# Altium schematic sheet Sheet3.SchDoc
size A4
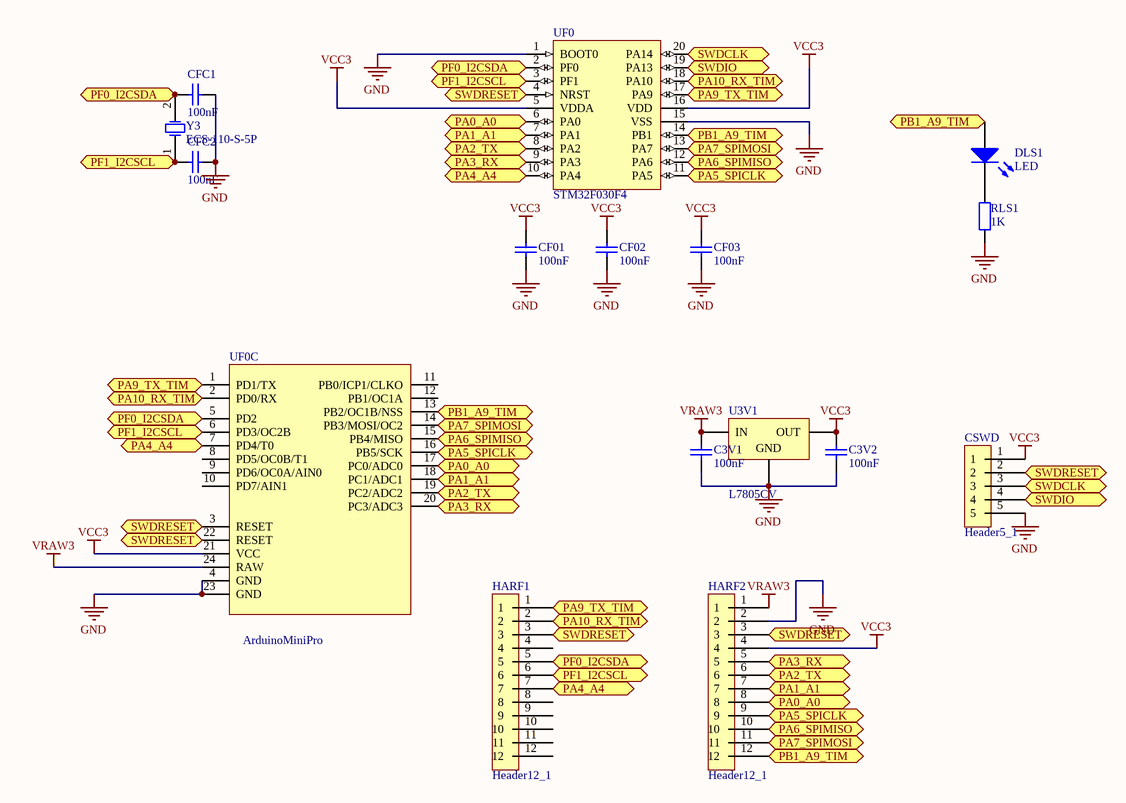
[diagram p0: Sheet3.SchDoc]

## Parts
C3V1  100nF  [FP_1206_CAP_125]
C3V2  100nF  [FP_1206_CAP_125]
CF01  100nF  [FP_0805_CAP_085]
CF02  100nF  [FP_0805_CAP_085]
CF03  100nF  [FP_0805_CAP_085]
CFC1  100nF  [FP_0805_CAP_085]
CFC2  100nF  [FP_0805_CAP_085]
CSWD  Header5_1  [HEADER5x1]
DLS1  LED  [FP_0805_LED_RED]
HARF1  Header12_1  [HEADER12x1]
HARF2  Header12_1  [HEADER12x1]
RLS1  value 1K  [0805]  (hidden comment: Resistor)
U3V1  L7805CV  [SOT-223]
UF0  STM32F030F4  [TSSOP20]
UF0C  ArduinoMiniPro  [DIP24]
Y3  ECS-110-S-5P  [Crystal]

## Ports
PA0_A0, PA1_A1, PA2_TX, PA3_RX, PA4_A4, PA5_SPICLK, PA6_SPIMISO, PA7_SPIMOSI, PA9_TX_TIM, PA10_RX_TIM, PB1_A9_TIM, PF0_I2CSDA, PF1_I2CSCL, SWDCLK, SWDIO, SWDRESET

## Nets
GND: C3V1.2 C3V2.2 CF01.1 CF02.1 CF03.1 CFC1.2 CFC2.2 CSWD.5 HARF2.2 RLS1.1 U3V1.GND UF0.1(BOOT0) UF0.15(VSS) UF0C.4(GND) UF0C.23(GND)
VCC3: C3V2.1 CF01.2 CF02.2 CF03.2 CSWD.1 HARF2.4 U3V1.OUT UF0.5(VDDA) UF0.16(VDD) UF0C.21(VCC)
VRAW3: C3V1.1 HARF2.1 U3V1.IN UF0C.24(RAW)
PA0_A0: HARF2.8 UF0.6(PA0) UF0C.17(PC0/ADC0) ; port PA0_A0
PA1_A1: HARF2.7 UF0.7(PA1) UF0C.18(PC1/ADC1) ; port PA1_A1
PA2_TX: HARF2.6 UF0.8(PA2) UF0C.19(PC2/ADC2) ; port PA2_TX
PA3_RX: HARF2.5 UF0.9(PA3) UF0C.20(PC3/ADC3) ; port PA3_RX
PA4_A4: HARF1.7 UF0.10(PA4) UF0C.7(PD4/T0) ; port PA4_A4
PA5_SPICLK: HARF2.9 UF0.11(PA5) UF0C.16(PB5/SCK) ; port PA5_SPICLK
PA6_SPIMISO: HARF2.10 UF0.12(PA6) UF0C.15(PB4/MISO) ; port PA6_SPIMISO
PA7_SPIMOSI: HARF2.11 UF0.13(PA7) UF0C.14(PB3/MOSI/OC2) ; port PA7_SPIMOSI
PA9_TX_TIM: HARF1.1 UF0.17(PA9) UF0C.1(PD1/TX) ; port PA9_TX_TIM
PA10_RX_TIM: HARF1.2 UF0.18(PA10) UF0C.2(PD0/RX) ; port PA10_RX_TIM
PB1_A9_TIM: DLS1.1(A) HARF2.12 UF0.14(PB1) UF0C.13(PB2/OC1B/NSS) ; port PB1_A9_TIM
PF0_I2CSDA: CFC1.1 HARF1.5 UF0.2(PF0) UF0C.5(PD2) Y3.2(OSC2) ; port PF0_I2CSDA
PF1_I2CSCL: CFC2.1 HARF1.6 UF0.3(PF1) UF0C.6(PD3/OC2B) Y3.1(OSC1) ; port PF1_I2CSCL
SWDCLK: CSWD.3 UF0.20(PA14) ; port SWDCLK
SWDIO: CSWD.4 UF0.19(PA13) ; port SWDIO
SWDRESET: CSWD.2 HARF1.3 HARF2.3 UF0.4(NRST) UF0C.3(RESET) UF0C.22(RESET) ; port SWDRESET
NetDLS1_2: DLS1.2(K) RLS1.2

Not connected (* = marked no-connect by the designer): HARF1 4 8 9 10 11 12; UF0C 8(PD5/OC0B/T1) 9(PD6/OC0A/AIN0) 10(PD7/AIN1) 11(PB0/ICP1/CLKO) 12(PB1/OC1A)

## Library data of the parts
C3V1 C3V2 CF01 CF02 CF03 CFC1 CFC2 = CAP: Capacitor; Value: 100nF
DLS1 = LED: Typical RED GaAs LED; pin to pad: 1>A 2>K
U3V1 = L7805CV: Positive Voltage Regulator; pin to pad: GND>1 IN>3 OUT>2; Note: Tab is connected to pin 3 (GND).; Published: 24-Aug-2001; LatestRevisionDate: 17-Jul-2002; LatestRevisionNote: Re-released for DXP Platform.; DatasheetVersion: Dec-1998; PackageVersion: Jun-1998; PackageReference: TO220ABN; Publisher: Altium Limited; PackageDescription: TO, Thru-Hole, Vertical, Heatsink Mounted; 3 In-Line Leads; Pitch 2.54 mm; Pin sequence 1, 3, 2; ComponentLink1Description: Manufacturer Link; ComponentLink1URL: http://www.st.com/
UF0 = STM32F030F4: STMICROELECTRONICS  STM32F030F4P6  MCU, 32BIT, CORTEX-M0, 48MHZ
Y3 = ECS-110-S-5P: Crystal Oscillator; Published: 17-Jul-2002; DatasheetDocument: 18-Apr-2000; PackageReference: CSM-7; Publisher: Altium Limited; ComponentLink1Description: Manufacturer Link; ComponentLink1URL: http://www.ecsxtal.com/; ComponentLink2Description: Datasheet; ComponentLink2URL: http://www.ecsxtal.com/pdf3/CSM_7.pdf
RLS1 = Resistor: Published: 8-Jun-2000; LatestRevisionDate: 17-Jul-2002; LatestRevisionNote: Re-released for DXP Platform.; PackageReference: AXIAL-0.4; Publisher: Altium Limited